# Altium schematic sheet Part17_I2C_SHT30.SchDoc
size A4
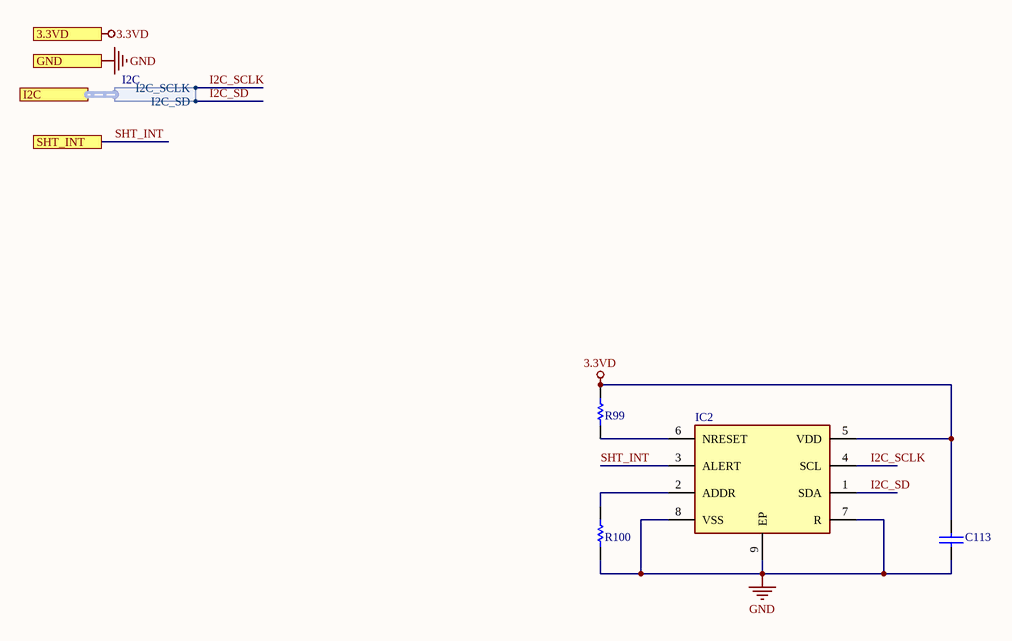
[diagram p0: Part17_I2C_SHT30.SchDoc]

## Parts
C113  100nF  [0402C]  (value not drawn)
IC2  SHT31-DIS-B2.5KS  [SON50P250X250X100-9N-D]  (value not drawn)
R99  10K  [0402R]  (value not drawn)
R100  10K  [0402R]  (value not drawn)

## Ports
3.3VD, GND, I2C (harness I2C), SHT_INT

## Harnesses
I2C: I2C_SCLK, I2C_SD

## Nets
3.3VD: C113.1 IC2.5(VDD) R99.2 ; port 3.3VD
GND: C113.2 IC2.7(R) IC2.8(VSS) IC2.9(EP) R100.1 ; port GND
I2C_SCLK: IC2.4(SCL) ; port I2C.I2C_SCLK
I2C_SD: IC2.1(SDA) ; port I2C.I2C_SD
SHT_INT: IC2.3(ALERT) ; port SHT_INT
NetIC2_2: IC2.2(ADDR) R100.2
NetIC2_6: IC2.6(NRESET) R99.1

## Library data of the parts
C113 = CAP: 无极性电容
IC2 = SHT31-DIS-B2.5KS: Integrated Circuit; Manufacturer_Name: Sensirion; Datasheet Link: http://www.mouser.com/ds/2/682/Sensirion_Humidity_Sensors_SHT3x_Datasheet_digital-971521.pdf; Height: 1mm; Manufacturer_Part_Number: SHT31-DIS-B2.5KS; Arrow Part Number: SHT31-DIS-B2.5KS; Arrow Price/Stock: https://www.arrow.com/en/products/sht31-dis-b2.5ks/sensirion-ag; Mouser Part Number: 403-SHT31-DIS-B; Mouser Price/Stock: https://www.mouser.co.uk/ProductDetail/Sensirion/SHT31-DIS-B25kS?qs=y6ZabgHbY%252ByCkzTLGvP3Qw%3D%3D
R99 R100 = RES